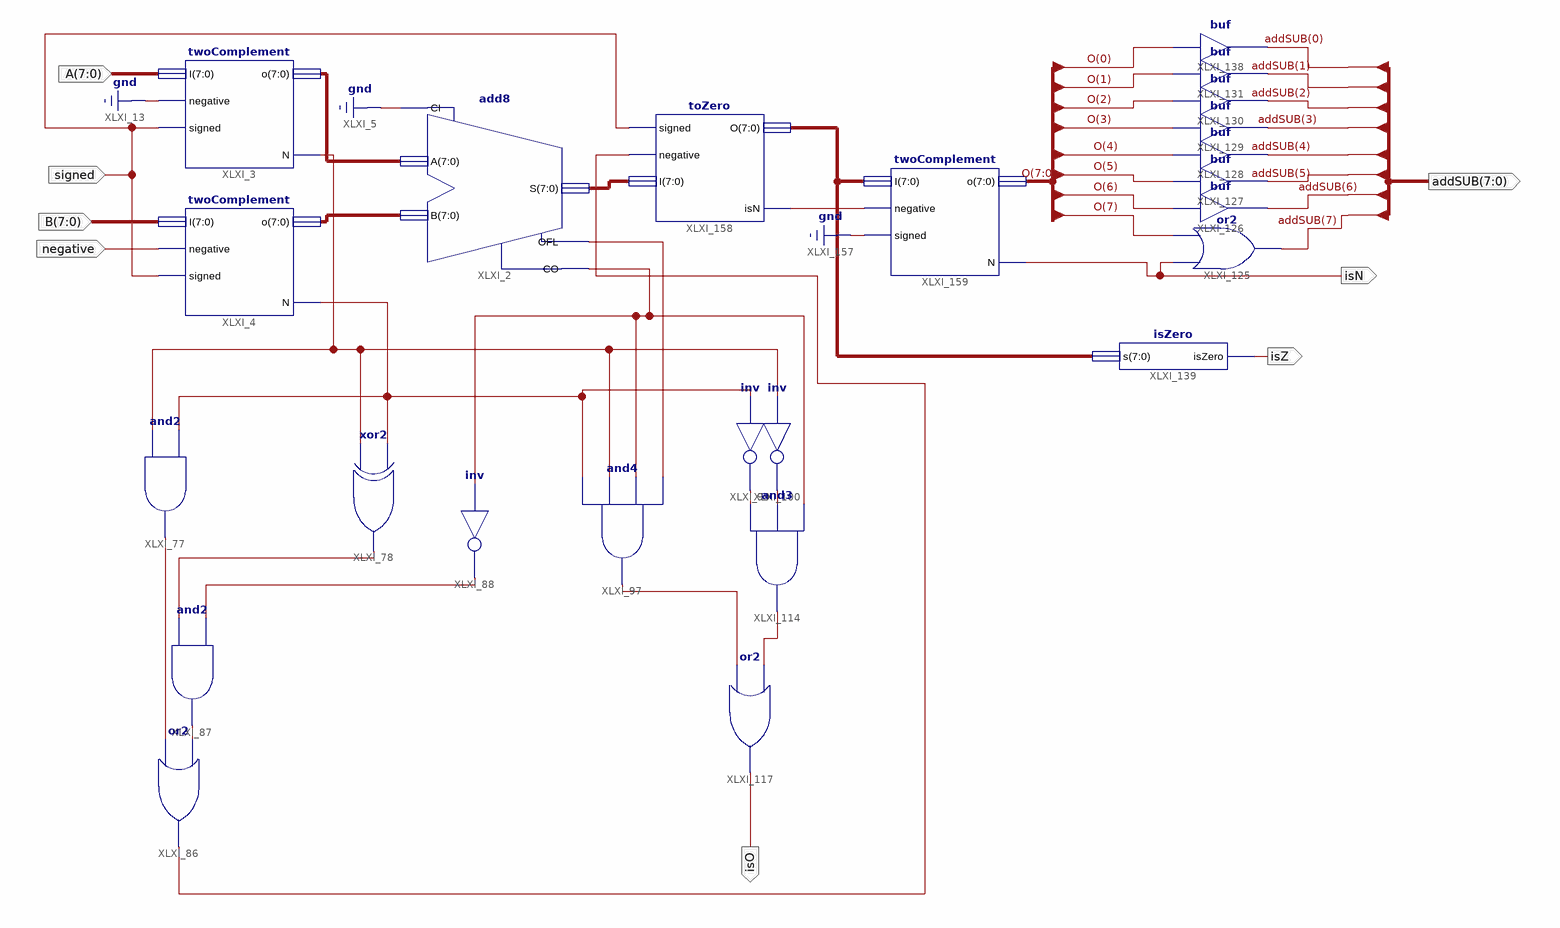
[diagram p0: schematic sheet 1]
// Xilinx ISE schematic addSUB.sch (spartan3e) as structural Verilog: 24 symbols, 8 ports
module addSUB (
  input  [7:0] A,
  input  [7:0] B,
  input  negative,
  input  \signed ,
  output isO,
  output [7:0] addSUB,
  output isZ,
  output isN
);

  wire XLXN_199, XLXN_200, XLXN_218, XLXN_221, XLXN_222, XLXN_224, XLXN_241, XLXN_242, XLXN_250, XLXN_252,
       XLXN_263, XLXN_271, XLXN_329, XLXN_341;
  wire [7:0] O, XLXN_3, XLXN_4, XLXN_305, XLXN_328;

  twoComplement XLXI_3 (.I(A), .negative(1'b0), .\signed (\signed ), .o(XLXN_3), .N(XLXN_200));
  twoComplement XLXI_4 (.I(B), .negative(negative), .\signed (\signed ), .o(XLXN_4), .N(XLXN_199));
  and XLXI_77 (XLXN_218, XLXN_200, XLXN_199);
  xor XLXI_78 (XLXN_224, XLXN_200, XLXN_199);
  not XLXI_88 (XLXN_222, XLXN_263);
  or XLXI_86 (XLXN_329, XLXN_218, XLXN_221);
  and XLXI_87 (XLXN_221, XLXN_224, XLXN_222);
  and XLXI_97 (XLXN_252, XLXN_199, XLXN_200, XLXN_263, XLXN_250);
  not XLXI_99 (XLXN_241, XLXN_199);
  not XLXI_100 (XLXN_242, XLXN_200);
  and XLXI_114 (XLXN_271, XLXN_241, XLXN_242, XLXN_263);
  or XLXI_117 (isO, XLXN_252, XLXN_271);
  or XLXI_125 (addSUB[7], isN, O[7]);
  buf XLXI_126 (addSUB[6], O[6]);
  buf XLXI_127 (addSUB[5], O[5]);
  buf XLXI_128 (addSUB[4], O[4]);
  buf XLXI_129 (addSUB[3], O[3]);
  buf XLXI_130 (addSUB[2], O[2]);
  buf XLXI_131 (addSUB[1], O[1]);
  buf XLXI_138 (addSUB[0], O[0]);
  isZero XLXI_139 (.s(XLXN_305), .isZero(isZ));
  add8 XLXI_2 (.A(XLXN_3), .B(XLXN_4), .CI(1'b0), .CO(XLXN_263), .OFL(XLXN_250), .S(XLXN_328));
  toZero XLXI_158 (.\signed (\signed ), .negative(XLXN_329), .I(XLXN_328), .O(XLXN_305), .isN(XLXN_341));
  twoComplement XLXI_159 (.I(XLXN_305), .negative(XLXN_341), .\signed (1'b0), .o(O), .N(isN));
endmodule
